# EAGLE schematic Rev_1 (EAGLE 9.5.2)
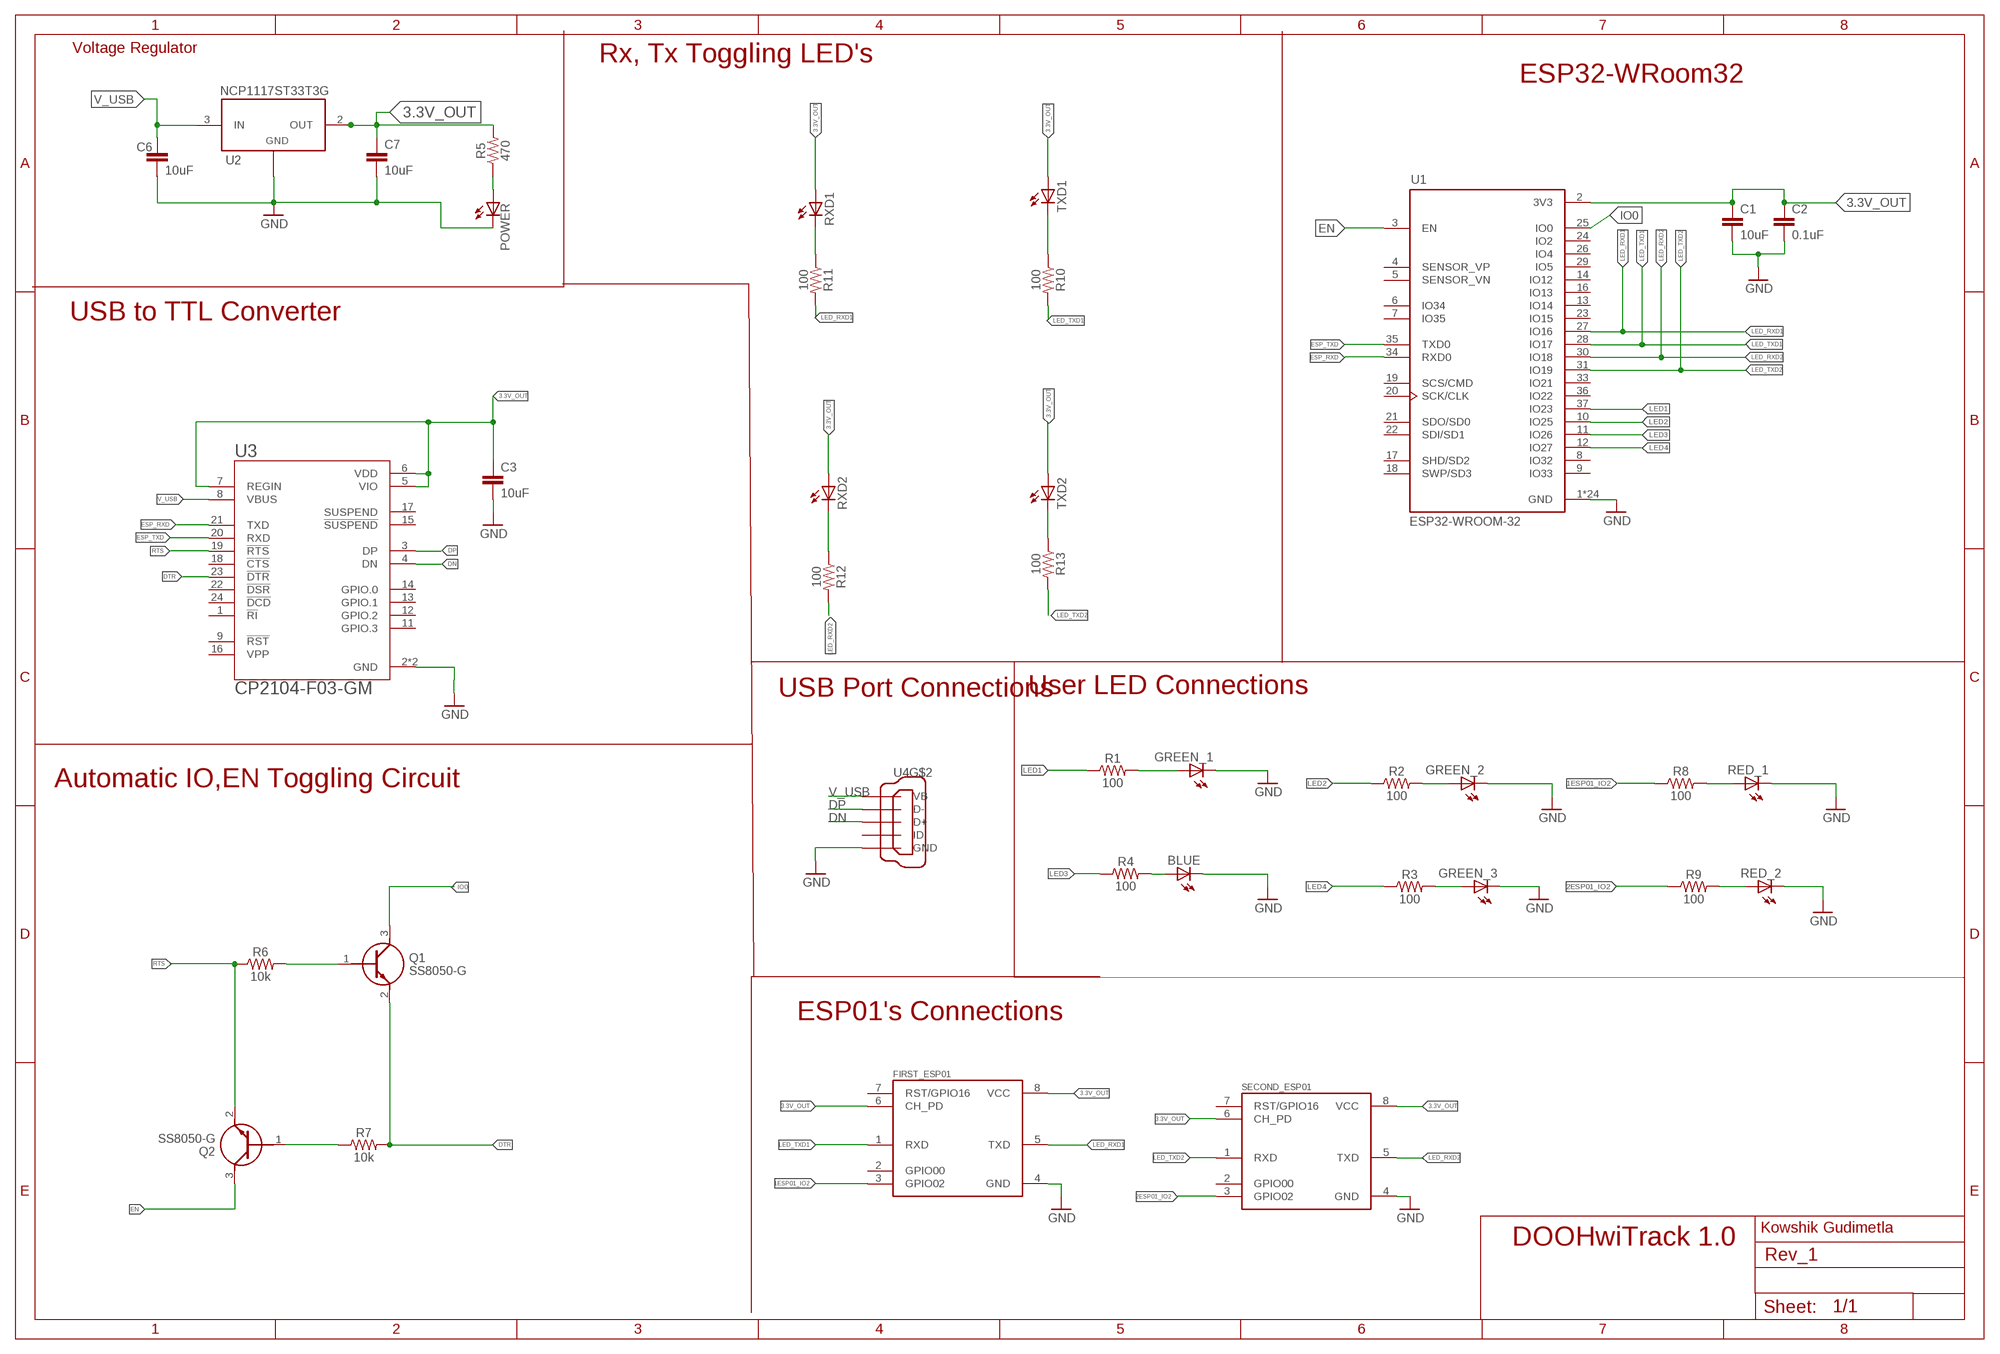
[diagram p0: schematic, sheet 1]

## Parts
BLUE  LEDCHIP-LED0805  [CHIP-LED0805]
C1  10uF  0.1UF-0402-16V-10%  [0402]
C2  0.1uF  0.1UF-0402-16V-10%  [0402]
C3  10uF  0.1UF-0402-16V-10%  [0402]
C6  10uF  0.1UF-0402-16V-10%  [0402]
C7  10uF  0.1UF-0402-16V-10%  [0402]
FIRST_ESP01  ESP8266-01/ESP-01  [XCVR_ESP8266-01/ESP-01]
GREEN_1  LEDCHIP-LED0805  [CHIP-LED0805]
GREEN_2  LEDCHIP-LED0805  [CHIP-LED0805]
GREEN_3  LEDCHIP-LED0805  [CHIP-LED0805]
POWER  LEDCHIP-LED0603  [CHIP-LED0603]
Q1  SS8050-G  [SOT95P240X115-3N]
Q2  SS8050-G  [SOT95P240X115-3N]
R1  100  100KOHM-0402-1/16W-1%  [0402]
R2  100  100KOHM-0402-1/16W-1%  [0402]
R3  100  100KOHM-0402-1/16W-1%  [0402]
R4  100  100KOHM-0402-1/16W-1%  [0402]
R5  470  100KOHM-0402-1/16W-1%  [0402]
R6  10k  100KOHM-0402-1/16W-1%  [0402]
R7  10k  100KOHM-0402-1/16W-1%  [0402]
R8  100  100KOHM-0402-1/16W-1%  [0402]
R9  100  100KOHM-0402-1/16W-1%  [0402]
R10  100  100KOHM-0402-1/16W-1%  [0402]
R11  100  100KOHM-0402-1/16W-1%  [0402]
R12  100  100KOHM-0402-1/16W-1%  [0402]
R13  100  100KOHM-0402-1/16W-1%  [0402]
RED_1  LEDCHIP-LED0805  [CHIP-LED0805]
RED_2  LEDCHIP-LED0805  [CHIP-LED0805]
RXD1  LEDCHIP-LED0805  [CHIP-LED0805]
RXD2  LEDCHIP-LED0805  [CHIP-LED0805]
SECOND_ESP01  ESP8266-01/ESP-01  [XCVR_ESP8266-01/ESP-01]
TXD1  LEDCHIP-LED0805  [CHIP-LED0805]
TXD2  LEDCHIP-LED0805  [CHIP-LED0805]
U1  ESP32-WROOM-32  [MODULE_ESP32-WROOM-32]
U2  NCP1117ST33T3G  [SOT-223]
U3  CP2104-F03-GM  [QFN50P400X400X80-25N]
U4  J_USB_MICROAB_HIROSE_ZX62-AB-5PA  [J_USB_MICROAB_HIROSE_ZX62-AB-5PA]

## Nets
1ESP01_IO2: FIRST_ESP01.3(GPIO02) R8.1
2ESP01_IO2: R9.1 SECOND_ESP01.3(GPIO02)
3.3V_OUT: C1.1 C2.1 C3.1 C7.1 FIRST_ESP01.6(CH_PD) FIRST_ESP01.8(VCC) R5.2 RXD1.A RXD2.A SECOND_ESP01.6(CH_PD) SECOND_ESP01.8(VCC) TXD1.A TXD2.A U1.2(3V3) U2.2(OUT) U2.4 U3.5(VIO) U3.6(VDD) U3.7(REGIN)
DN: U3.4(DN) U4.P$3(D+)
DP: U3.3(DP) U4.P$2(D-)
DTR: Q1.2(E) R7.2 U3.23(!DTR)
EN: Q2.3(C) U1.3(EN)
ESP_RXD: U1.34(RXD0) U3.21(TXD)
ESP_TXD: U1.35(TXD0) U3.20(RXD)
GND: BLUE.C C1.2 C2.2 C3.2 C6.2 C7.2 FIRST_ESP01.4(GND) GREEN_1.C GREEN_2.C GREEN_3.C POWER.C RED_1.C RED_2.C SECOND_ESP01.4(GND) U1.1(GND) U1.15(GND) U1.38(GND) U1.39_1(GND) U1.39_2(GND) U1.39_3(GND) U1.39_4(GND) U1.39_5(GND) U1.39_6(GND) U1.39_7(GND) U1.39_8(GND) U1.39_9(GND) U1.39_10(GND) U1.39_11(GND) U1.39_12(GND) U1.39_13(GND) U1.39_14(GND) U1.39_15(GND) U1.39_16(GND) U1.39_17(GND) U1.39_18(GND) U1.39_19(GND) U1.39_20(GND) U1.39_21(GND) U2.1(ADJ/GND) U3.2(GND) U3.25(GND) U4.P$5(GND)
IO0: Q1.3(C) U1.25(IO0)
LED1: R1.1 U1.37(IO23)
LED2: R2.1 U1.10(IO25)
LED3: R4.1 U1.11(IO26)
LED4: R3.1 U1.12(IO27)
LED_RXD1: FIRST_ESP01.5(TXD) R11.2 U1.27(IO16)
LED_RXD2: R12.2 SECOND_ESP01.5(TXD) U1.30(IO18)
LED_TXD1: FIRST_ESP01.1(RXD) R10.2 U1.28(IO17)
LED_TXD2: R13.2 SECOND_ESP01.1(RXD) U1.31(IO19)
N$3: GREEN_1.A R1.2
N$4: GREEN_2.A R2.2
N$5: GREEN_3.A R3.2
N$6: BLUE.A R4.2
N$8: POWER.A R5.1
N$11: R8.2 RED_1.A
N$12: Q1.1(B) R6.2
N$13: Q2.1(B) R7.1
N$14: R9.2 RED_2.A
N$15: R10.1 TXD1.C
N$17: R12.1 RXD2.C
N$18: R13.1 TXD2.C
N$21: R11.1 RXD1.C
RTS: Q2.2(E) R6.1 U3.19(!RTS)
V_USB: C6.1 U2.3(IN) U3.8(VBUS) U4.P$1(VB)
Unconnected: FIRST_ESP01.2(GPIO00) FIRST_ESP01.7(RST/GPIO16) SECOND_ESP01.2(GPIO00) SECOND_ESP01.7(RST/GPIO16) U1.4(SENSOR_VP) U1.5(SENSOR_VN) U1.6(IO34) U1.7(IO35) U1.8(IO32) U1.9(IO33) U1.13(IO14) U1.14(IO12) U1.16(IO13) U1.17(SHD/SD2) U1.18(SWP/SD3) U1.19(SCS/CMD) U1.20(SCK/CLK) U1.21(SDO/SD0) U1.22(SDI/SD1) U1.23(IO15) U1.24(IO2) U1.26(IO4) U1.29(IO5) U1.33(IO21) U1.36(IO22) U3.1(!RI) U3.9(!RST!) U3.11(GPIO.3) U3.12(GPIO.2) U3.13(GPIO.1) U3.14(GPIO.0) U3.15(!SUSPEND!) U3.16(VPP) U3.17(SUSPEND) U3.18(!CTS) U3.22(!DSR) U3.24(!DCD) U4.P$4(ID) U4.SHIELD1(S1) U4.SHIELD2(S2) U4.SHIELD3(S3) U4.SHIELD4(S4)

## Notes on the sheet
- Voltage Regulator
- Rx, Tx Toggling LED's
- ESP32-WRoom32
- USB to TTL Converter
- USB Port Connections | User LED Connections
- Automatic IO,EN Toggling Circuit
- ESP01's Connections
- Kowshik Gudimetla
- DOOHwiTrack 1.0

## Library data of the parts
BLUE GREEN_1-GREEN_3 POWER RED_1 RED_2 RXD1 RXD2 TXD1 TXD2 = adafruit:LED: LED OSRAM: - CHIPLED LG R971, LG N971, LY N971, LG Q971, LY Q971, LO R971, LY R971 LH N974, LH R974 LS Q976, LO Q976, LY Q976 LO Q996 - Hyper CHIPLED LW Q18S LB Q993, LB Q99A, LB R99A - SideLED LS A670, LO A670, LY A670, LG A670, LP A670 LB A673, LV A673, LT A673, LW A673 LH A674 LY A675 LS A676, LA A676, LO A676, LY A676, LW A676 LS A679, LY A679, LG A679 - Hyper Micro SIDELED® LS Y876, LA Y876, LO Y876, LY Y876 LT Y87S - SmartLED LW L88C, LW L88S LB L89C, LB L89S, LG L890 LS L89K, LO L89K, LY L89K LS L896, LA L896, LO L896, LY L896 - TOPLED LS T670, LO T670, LY T670, LG T670, LP T670 LSG T670, LSP T670, LSY T670, LOP T670, LYG T670 LG T671, LOG T671, LSG T671 LB T673, LV T673, LT T673, LW T673 LH T674 LS T676, LA T676, LO T676, LY T676, LB T676, LH T676, LSB T676, LW T676 LB T67C, LV T67C, LT T67C, LS T67K, LO T67K, LY T67K, LW E67C LS E67B, LA E67B, LO E67B, LY E67B, LB E67C, LV E67C, LT E67C LW T67C LS T679, LY T679, LG T679 LS T770, LO T770, LY T770, LG T770, LP T770 LB T773, LV T773, LT T773, LW T773 LH T774 LS E675, LA E675, LY E675, LS T675 LS T776, LA T776, LO T776, LY T776, LB T776 LHGB T686 LT T68C, LB T68C - Hyper Mini TOPLED® LB M676 - Mini TOPLED Santana® LG M470 LS M47K, LO M47K, LY M47K Source: http://www.osram.convergy.de/
C1 C3 C6 C7 = SparkFun-Capacitors:0.1UF: 0.1µF ceramic capacitors A capacitor is a passive two-terminal electrical component used to store electrical energy temporarily in an electric field.; PROD_ID: CAP-12416; VALUE: 0.1uF
C2 = SparkFun-Capacitors:0.1UF: 0.1µF ceramic capacitors A capacitor is a passive two-terminal electrical component used to store electrical energy temporarily in an electric field.; PROD_ID: CAP-12416
FIRST_ESP01 SECOND_ESP01 = ESP8266-01_ESP-01:ESP8266-01/ESP-01: ESP-01 wifi module; AVAILABILITY: Unavailable; MF: AI-Thinker; MP: ESP8266-01/ESP-01; PACKAGE: None; PRICE: None
Q1 Q2 = SS8050-G_NPN_transistor:SS8050-G: Bipolar Transistors - BJT NPN TRANSISTOR 1.5A 40V Source: Datasheet <http://www.comchiptech.com/admin/files/product/SS8050-G RevA181526.pdf>; AVAILABILITY: Unavailable; DESCRIPTION: Bipolar _BJT_ Transistor NPN 25V 1.5A 100MHz 300mW Surface Mount SOT-23; MF: Comchip Technology; MP: SS8050-G; PACKAGE: TO-236 Comchip; PRICE: None
R1-R13 = SparkFun-Resistors:100KOHM: 100kΩ resistor A resistor is a passive two-terminal electrical component that implements electrical resistance as a circuit element. Resistors act to reduce current flow, and, at the same time, act to lower voltage levels within circuits. - Wikipedia; PROD_ID: RES-13495; VALUE: 100K
U1 = ESP32-WROOM-32:ESP32-WROOM-32: Bluetooth, WiFi Transceiver Module 2.4GHz ~ 2.5GHz Surface Mount; AVAILABILITY: Unavailable; DESCRIPTION: Bluetooth, WiFi 802.11b/g/n, Bluetooth v4.2 + EDR, Class 1, 2 and 3 Transceiver Module 2.4GHz ~ 2.5GHz Integrated, Trace Surface Mount; MF: Espressif Systems; MP: ESP32-WROOM-32; PACKAGE: Module Espressif Systems; PRICE: None
U2 = IC:NCP1117ST33T3G: IC REG LINEAR 3.3V 1A SOT223 Manufacturer's datasheet <https://www.onsemi.com/pub/Collateral/NCP1117-D.PDF>; CREATED_BY: PCBLayout.com; DIGIKEY_PART_NUMBER: NCP1117ST33T3GOSTR-ND; MANUFACTURER: ON Semiconductor; MPN: NCP1117ST33T3G; PACKAGE: SOT-223
U3 = CP2104_actual:CP2104: Silabs CP2104 USB to UART Bridge; AVAILABILITY: Unavailable; DESCRIPTION: USB Bridge, USB to UART USB 2.0 UART Interface 24-QFN _4x4_; MF: Silicon Labs; MP: CP2104; PACKAGE: QFN-24 Silicon Labs; PRICE: None
U4 = eagle_MUSB_2:J_USB_MICROAB_HIROSE_ZX62-AB-5PA: USB Micro-AB SMT connector Hirose Electric Co Ltd: ZX62-AB-5P